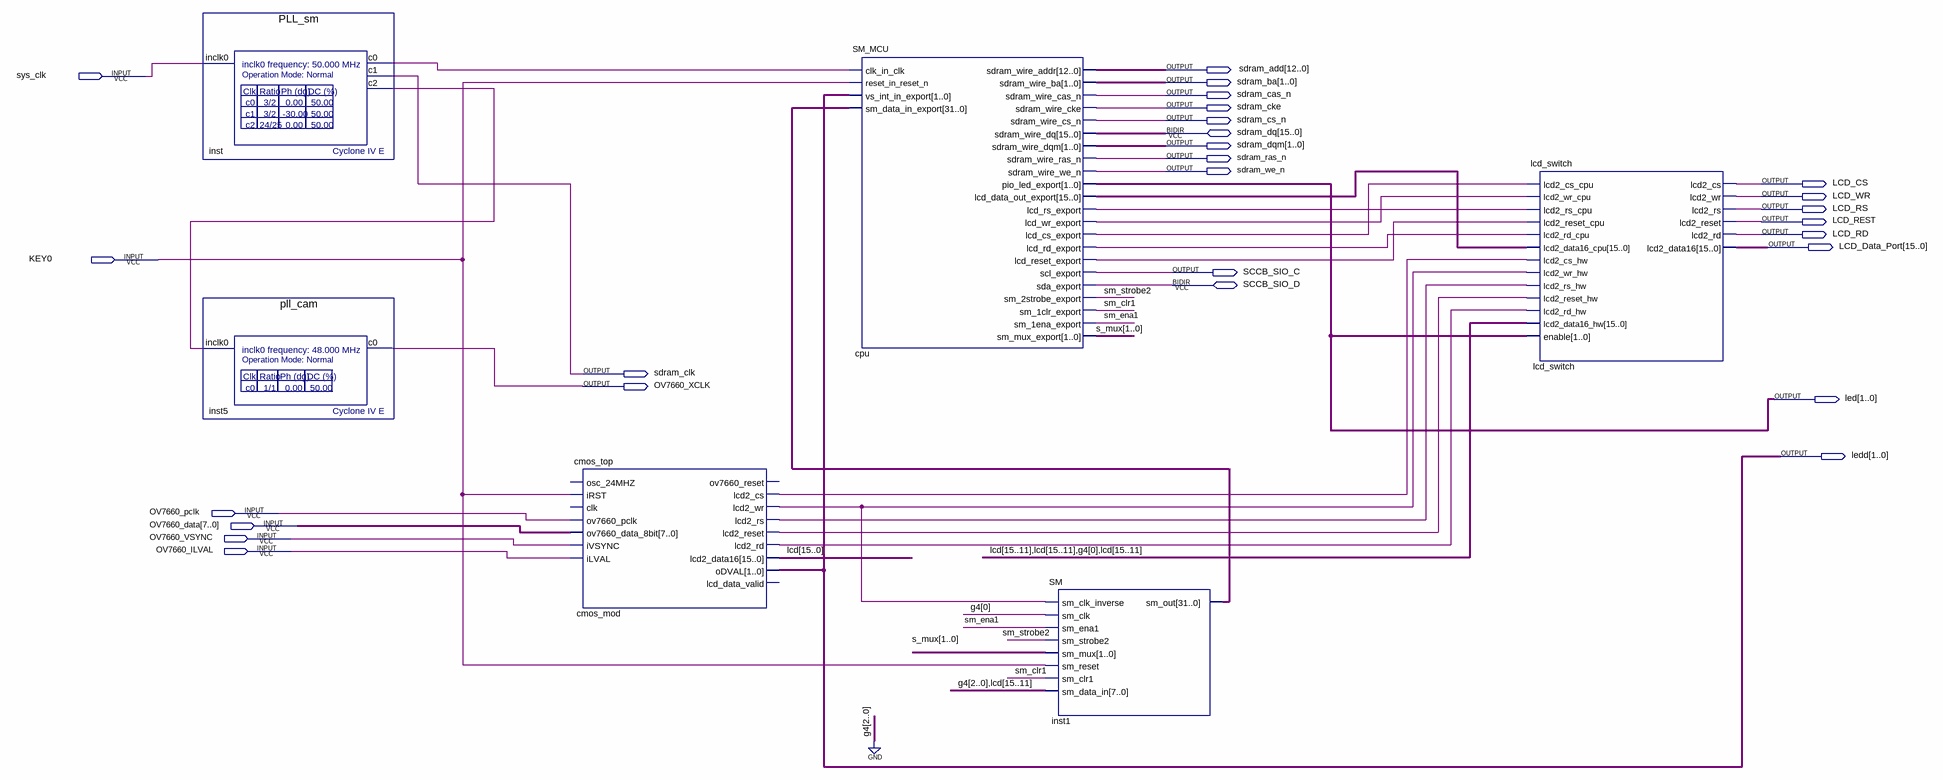
[diagram p0: schematic sheet]
// Quartus schematic SM_cam_tft.bdf as structural Verilog: 6 symbols, 27 pins
module SM_cam_tft (
  input  sys_clk,
  input  KEY0,
  input  OV7660_pclk,
  input  [7:0] OV7660_data,
  input  OV7660_VSYNC,
  input  OV7660_ILVAL,
  inout  [15:0] sdram_dq,
  inout  SCCB_SIO_D,
  output [12:0] sdram_add,
  output [1:0] sdram_ba,
  output sdram_cas_n,
  output sdram_cke,
  output sdram_cs_n,
  output [1:0] sdram_dqm,
  output sdram_ras_n,
  output sdram_we_n,
  output LCD_CS,
  output LCD_WR,
  output LCD_RS,
  output LCD_REST,
  output LCD_RD,
  output [15:0] LCD_Data_Port,
  output SCCB_SIO_C,
  output sdram_clk,
  output OV7660_XCLK,
  output [1:0] led,
  output [1:0] ledd
);

  wire cmos_mod_lcd2_cs, cmos_mod_lcd2_rd, cmos_mod_lcd2_reset, cmos_mod_lcd2_rs, cmos_mod_lcd2_wr,
       cpu_lcd_cs_export, cpu_lcd_rd_export, cpu_lcd_reset_export, cpu_lcd_rs_export, cpu_lcd_wr_export,
       inst_c0, inst_c2, sm_clr1, sm_ena1, sm_strobe2;
  wire [1:0] s_mux;
  wire [15:0] cpu_lcd_data_out_export, lcd;
  wire [31:0] inst1_sm_out;

  PLL_sm inst (.inclk0(sys_clk), .c0(inst_c0), .c1(sdram_clk), .c2(inst_c2));
  pll_cam inst5 (.inclk0(inst_c2), .c0(OV7660_XCLK));
  cmos_top cmos_mod (
    .iRST(KEY0), .ov7660_pclk(OV7660_pclk), .ov7660_data_8bit(OV7660_data), .iVSYNC(OV7660_VSYNC),
    .iLVAL(OV7660_ILVAL), .lcd2_cs(cmos_mod_lcd2_cs), .lcd2_wr(cmos_mod_lcd2_wr), .lcd2_rs(cmos_mod_lcd2_rs),
    .lcd2_reset(cmos_mod_lcd2_reset), .lcd2_rd(cmos_mod_lcd2_rd), .lcd2_data16(lcd), .oDVAL(ledd));  // open: osc_24MHZ, clk, ov7660_reset, lcd_data_valid
  SM_MCU cpu (
    .clk_in_clk(inst_c0), .reset_in_reset_n(KEY0), .vs_int_in_export(ledd), .sm_data_in_export(inst1_sm_out),
    .sdram_wire_addr(sdram_add), .sdram_wire_ba(sdram_ba), .sdram_wire_cas_n(sdram_cas_n),
    .sdram_wire_cke(sdram_cke), .sdram_wire_cs_n(sdram_cs_n), .sdram_wire_dqm(sdram_dqm),
    .sdram_wire_ras_n(sdram_ras_n), .sdram_wire_we_n(sdram_we_n), .pio_led_export(led),
    .lcd_data_out_export(cpu_lcd_data_out_export), .lcd_rs_export(cpu_lcd_rs_export),
    .lcd_wr_export(cpu_lcd_wr_export), .lcd_cs_export(cpu_lcd_cs_export), .lcd_rd_export(cpu_lcd_rd_export),
    .lcd_reset_export(cpu_lcd_reset_export), .scl_export(SCCB_SIO_C), .sm_2strobe_export(sm_strobe2),
    .sm_1clr_export(sm_clr1), .sm_1ena_export(sm_ena1), .sm_mux_export(s_mux), .sdram_wire_dq(sdram_dq),
    .sda_export(SCCB_SIO_D));
  SM inst1 (
    .sm_clk_inverse(cmos_mod_lcd2_wr), .sm_clk(1'b0), .sm_ena1(sm_ena1), .sm_strobe2(sm_strobe2),
    .sm_mux(s_mux), .sm_reset(KEY0), .sm_clr1(sm_clr1), .sm_data_in({3'b000, lcd[15:11]}),
    .sm_out(inst1_sm_out));
  lcd_switch lcd_switch (
    .lcd2_cs_cpu(cpu_lcd_cs_export), .lcd2_wr_cpu(cpu_lcd_wr_export), .lcd2_rs_cpu(cpu_lcd_rs_export),
    .lcd2_reset_cpu(cpu_lcd_reset_export), .lcd2_rd_cpu(cpu_lcd_rd_export),
    .lcd2_data16_cpu(cpu_lcd_data_out_export), .lcd2_cs_hw(cmos_mod_lcd2_cs), .lcd2_wr_hw(cmos_mod_lcd2_wr),
    .lcd2_rs_hw(cmos_mod_lcd2_rs), .lcd2_reset_hw(cmos_mod_lcd2_reset), .lcd2_rd_hw(cmos_mod_lcd2_rd),
    .lcd2_data16_hw({lcd[15:11], lcd[15:11], 1'b0, lcd[15:11]}), .enable(led), .lcd2_cs(LCD_CS),
    .lcd2_wr(LCD_WR), .lcd2_rs(LCD_RS), .lcd2_reset(LCD_REST), .lcd2_rd(LCD_RD), .lcd2_data16(LCD_Data_Port));
endmodule
